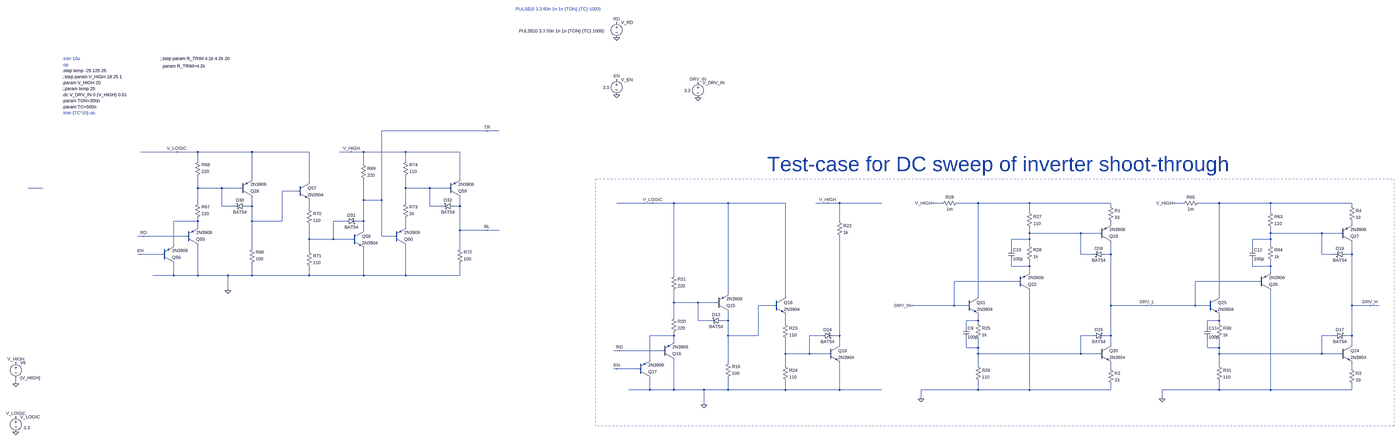
[diagram p0: schematic line_switch_driver.asc, whole sheet]
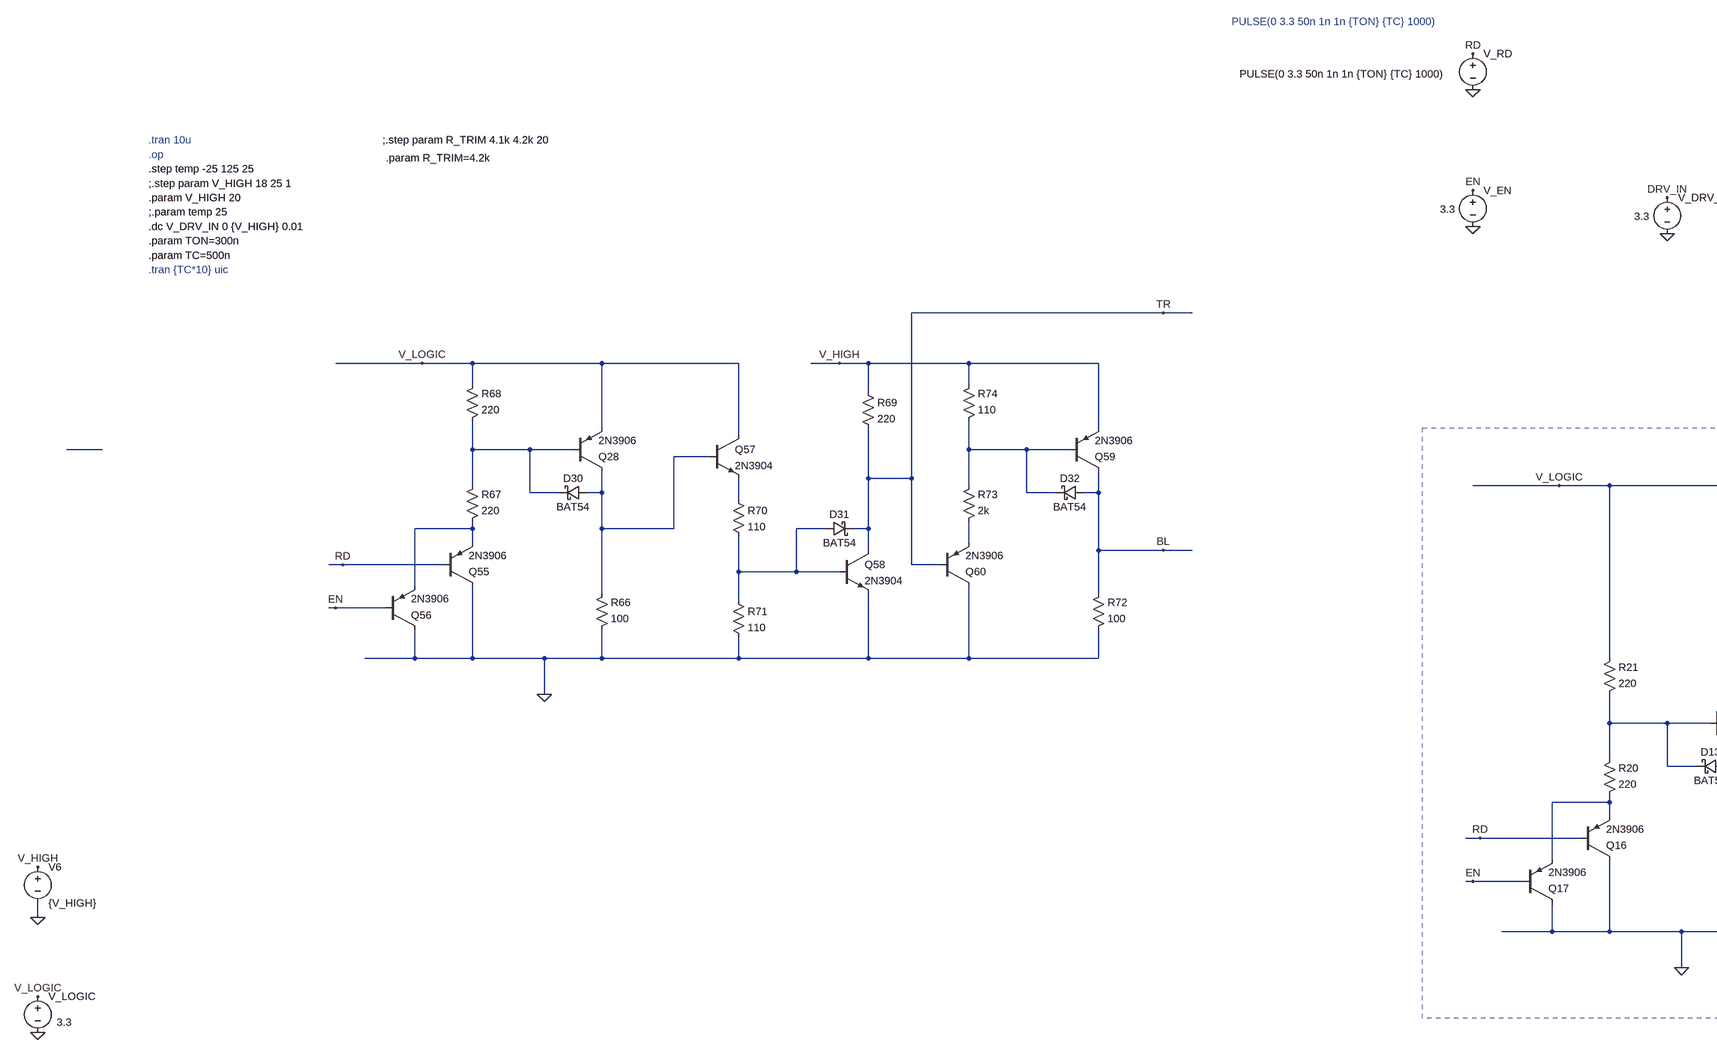
[diagram p1: schematic line_switch_driver.asc, part, row 1 of 1, column 1 of 2]
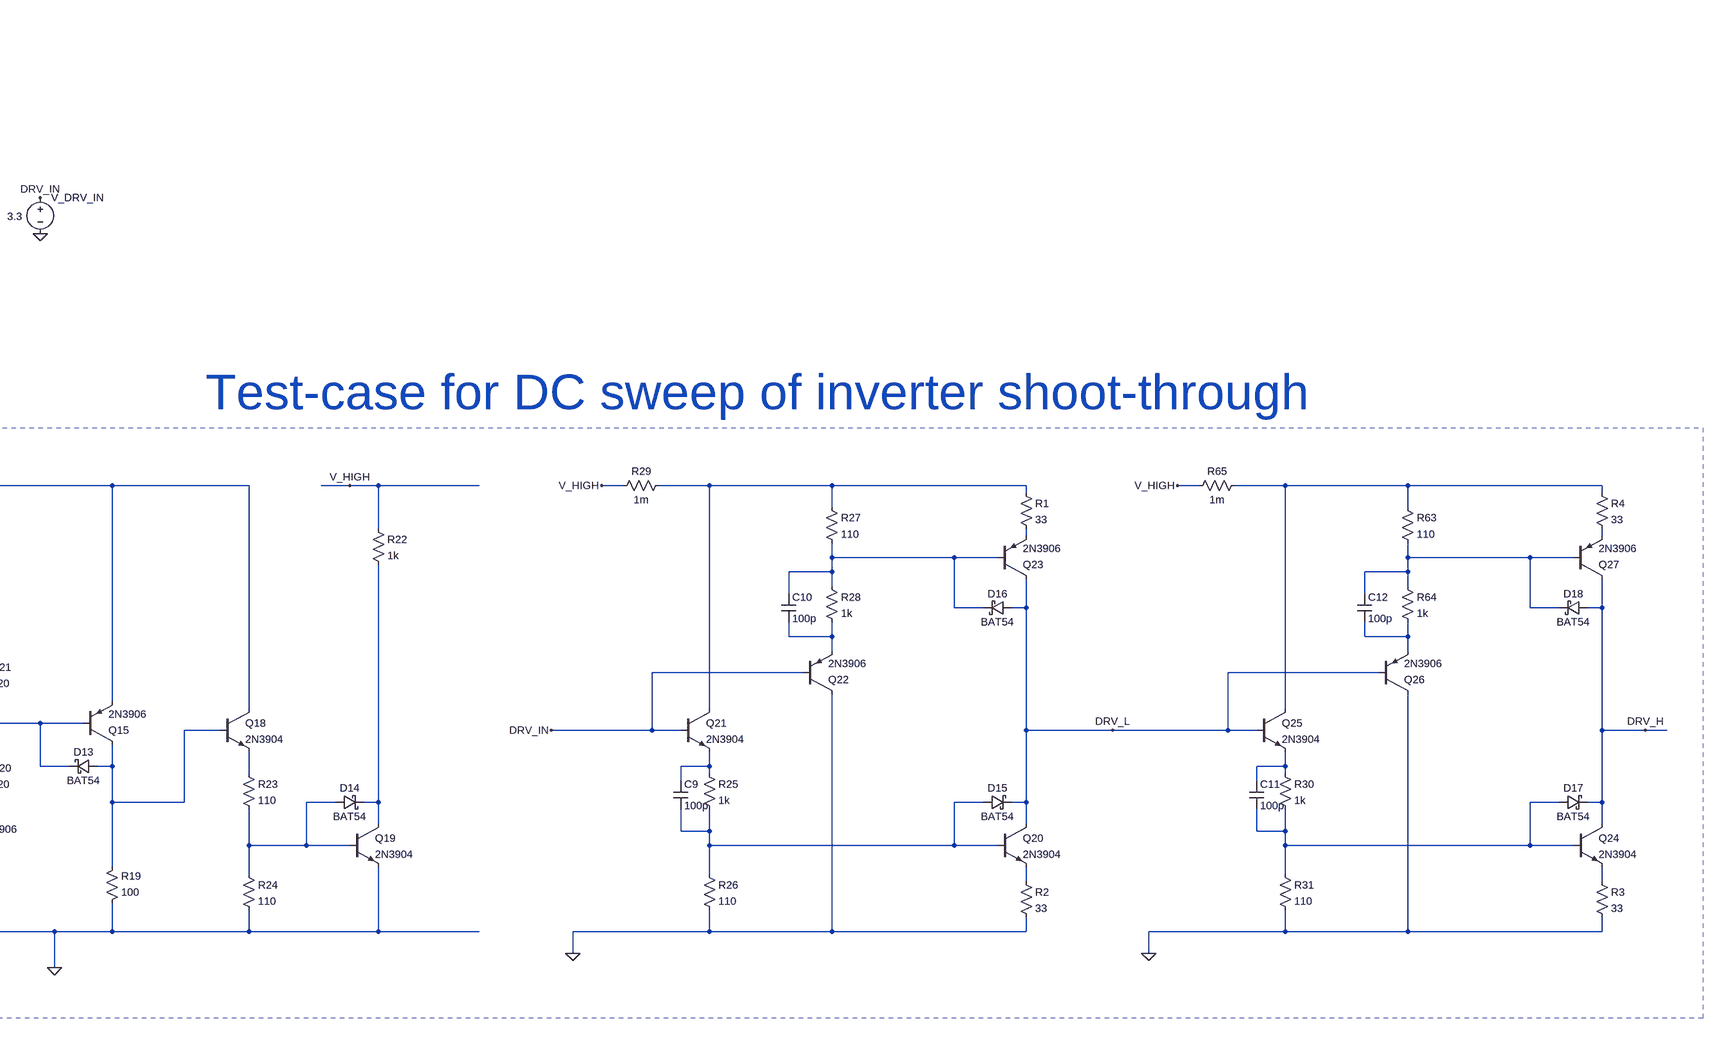
[diagram p2: schematic line_switch_driver.asc, part, row 1 of 1, column 2 of 2]
line_switch_driver.asc, the LTspice schematic file:
Version 4.1
SHEET 1 8816 5700
WIRE -1008 256 -1568 256
WIRE -944 256 -1008 256
WIRE -2656 368 -2848 368
WIRE -2544 368 -2656 368
WIRE -2256 368 -2544 368
WIRE -1952 368 -2256 368
WIRE -1728 368 -1792 368
WIRE -1664 368 -1728 368
WIRE -1440 368 -1664 368
WIRE -1152 368 -1440 368
WIRE -2544 416 -2544 368
WIRE -1440 416 -1440 368
WIRE -1664 432 -1664 368
WIRE -2256 512 -2256 368
WIRE -1152 512 -1152 368
WIRE -1952 528 -1952 368
WIRE -3376 560 -3456 560
WIRE -2544 560 -2544 496
WIRE -2416 560 -2544 560
WIRE -2320 560 -2416 560
WIRE -1440 560 -1440 496
WIRE -1312 560 -1440 560
WIRE -1216 560 -1312 560
WIRE -2016 576 -2096 576
WIRE -1664 624 -1664 512
WIRE -1568 624 -1568 256
WIRE -1568 624 -1664 624
WIRE -2544 640 -2544 560
WIRE -1440 640 -1440 560
WIRE -128 640 -320 640
WIRE -16 640 -128 640
WIRE 272 640 -16 640
WIRE 576 640 272 640
WIRE 800 640 736 640
WIRE 864 640 800 640
WIRE 1088 640 864 640
WIRE 1408 640 1360 640
WIRE 1600 640 1488 640
WIRE 1872 640 1600 640
WIRE 2304 640 1872 640
WIRE 2688 640 2640 640
WIRE 2880 640 2768 640
WIRE 3152 640 2880 640
WIRE 3584 640 3152 640
WIRE -2416 656 -2416 560
WIRE -2352 656 -2416 656
WIRE -2256 656 -2256 608
WIRE -2256 656 -2288 656
WIRE -1312 656 -1312 560
WIRE -1248 656 -1312 656
WIRE -1152 656 -1152 608
WIRE -1152 656 -1184 656
WIRE 2304 656 2304 640
WIRE 3584 656 3584 640
WIRE -1952 672 -1952 624
WIRE 1872 688 1872 640
WIRE 3152 688 3152 640
WIRE -2544 736 -2544 720
WIRE -2544 736 -2672 736
WIRE -2256 736 -2256 656
WIRE -2096 736 -2096 576
WIRE -2096 736 -2256 736
WIRE -1760 736 -1824 736
WIRE -1664 736 -1664 624
WIRE -1664 736 -1696 736
WIRE 864 736 864 640
WIRE 2304 752 2304 736
WIRE 3584 752 3584 736
WIRE -2544 768 -2544 736
WIRE -1440 768 -1440 720
WIRE -1664 784 -1664 736
WIRE -1152 784 -1152 656
WIRE -1008 784 -1152 784
WIRE -944 784 -1008 784
WIRE 1872 800 1872 768
WIRE 2144 800 1872 800
WIRE 2240 800 2144 800
WIRE 3152 800 3152 768
WIRE 3424 800 3152 800
WIRE 3520 800 3424 800
WIRE -2832 816 -2864 816
WIRE -2608 816 -2832 816
WIRE -1568 816 -1568 624
WIRE -1504 816 -1568 816
WIRE -1952 832 -1952 752
WIRE -1824 832 -1824 736
WIRE -1824 832 -1952 832
WIRE -1728 832 -1824 832
WIRE 1872 832 1872 800
WIRE 1872 832 1776 832
WIRE 3152 832 3152 800
WIRE 3152 832 3056 832
WIRE -2672 864 -2672 736
WIRE 1872 864 1872 832
WIRE 3152 864 3152 832
WIRE -2256 880 -2256 736
WIRE -1152 880 -1152 784
WIRE 1776 880 1776 832
WIRE 3056 880 3056 832
WIRE -1952 896 -1952 832
WIRE -2848 912 -2864 912
WIRE -2736 912 -2848 912
WIRE 2144 912 2144 800
WIRE 2208 912 2144 912
WIRE 2304 912 2304 848
WIRE 2304 912 2272 912
WIRE 3424 912 3424 800
WIRE 3488 912 3424 912
WIRE 3584 912 3584 848
WIRE 3584 912 3552 912
WIRE 1776 976 1776 944
WIRE 1872 976 1872 944
WIRE 1872 976 1776 976
WIRE 3056 976 3056 944
WIRE 3152 976 3152 944
WIRE 3152 976 3056 976
WIRE 1872 1008 1872 976
WIRE 3152 1008 3152 976
WIRE -2672 1024 -2672 960
WIRE -2672 1024 -2784 1024
WIRE -2544 1024 -2544 864
WIRE -2544 1024 -2672 1024
WIRE -2384 1024 -2544 1024
WIRE -2256 1024 -2256 960
WIRE -2256 1024 -2384 1024
WIRE -1952 1024 -1952 976
WIRE -1952 1024 -2256 1024
WIRE -1664 1024 -1664 880
WIRE -1664 1024 -1952 1024
WIRE -1440 1024 -1440 864
WIRE -1440 1024 -1664 1024
WIRE -1152 1024 -1152 960
WIRE -1152 1024 -1440 1024
WIRE -16 1024 -16 640
WIRE 1808 1056 1472 1056
WIRE 3088 1056 2752 1056
WIRE -2384 1104 -2384 1024
WIRE 272 1120 272 640
WIRE 576 1136 576 640
WIRE 1600 1136 1600 640
WIRE 2880 1136 2880 640
WIRE -16 1168 -16 1104
WIRE 112 1168 -16 1168
WIRE 208 1168 112 1168
WIRE 512 1184 432 1184
WIRE 1472 1184 1472 1056
WIRE 1472 1184 1248 1184
WIRE 1536 1184 1472 1184
WIRE 2304 1184 2304 912
WIRE 2496 1184 2304 1184
WIRE 2752 1184 2752 1056
WIRE 2752 1184 2496 1184
WIRE 2816 1184 2752 1184
WIRE 3584 1184 3584 912
WIRE 3680 1184 3584 1184
WIRE 3728 1184 3680 1184
WIRE -16 1248 -16 1168
WIRE 112 1264 112 1168
WIRE 176 1264 112 1264
WIRE 272 1264 272 1216
WIRE 272 1264 240 1264
WIRE 1600 1264 1600 1232
WIRE 1600 1264 1536 1264
WIRE 2880 1264 2880 1232
WIRE 2880 1264 2816 1264
WIRE 576 1280 576 1232
WIRE 1600 1280 1600 1264
WIRE 2880 1280 2880 1264
WIRE 1536 1296 1536 1264
WIRE 2816 1296 2816 1264
WIRE -16 1344 -16 1328
WIRE -16 1344 -144 1344
WIRE 272 1344 272 1264
WIRE 432 1344 432 1184
WIRE 432 1344 272 1344
WIRE 768 1344 704 1344
WIRE 864 1344 864 816
WIRE 864 1344 832 1344
WIRE 2208 1344 2144 1344
WIRE 2304 1344 2304 1184
WIRE 2304 1344 2272 1344
WIRE 3488 1344 3424 1344
WIRE 3584 1344 3584 1184
WIRE 3584 1344 3552 1344
WIRE -16 1376 -16 1344
WIRE 864 1392 864 1344
WIRE 2304 1392 2304 1344
WIRE 3584 1392 3584 1344
WIRE 1536 1408 1536 1360
WIRE 1600 1408 1600 1360
WIRE 1600 1408 1536 1408
WIRE 2816 1408 2816 1360
WIRE 2880 1408 2880 1360
WIRE 2880 1408 2816 1408
WIRE -304 1424 -336 1424
WIRE -80 1424 -304 1424
WIRE 576 1440 576 1360
WIRE 704 1440 704 1344
WIRE 704 1440 576 1440
WIRE 800 1440 704 1440
WIRE 1600 1440 1600 1408
WIRE 2144 1440 2144 1344
WIRE 2144 1440 1600 1440
WIRE 2240 1440 2144 1440
WIRE 2880 1440 2880 1408
WIRE 3424 1440 3424 1344
WIRE 3424 1440 2880 1440
WIRE 3520 1440 3424 1440
WIRE -144 1472 -144 1344
WIRE 272 1488 272 1344
WIRE 576 1504 576 1440
WIRE 1600 1504 1600 1440
WIRE 2880 1504 2880 1440
WIRE -320 1520 -336 1520
WIRE -208 1520 -320 1520
WIRE 2304 1520 2304 1488
WIRE 3584 1520 3584 1488
WIRE -3520 1600 -3520 1568
WIRE -144 1632 -144 1568
WIRE -144 1632 -256 1632
WIRE -16 1632 -16 1472
WIRE -16 1632 -144 1632
WIRE 144 1632 -16 1632
WIRE 272 1632 272 1568
WIRE 272 1632 144 1632
WIRE 576 1632 576 1584
WIRE 576 1632 272 1632
WIRE 864 1632 864 1488
WIRE 864 1632 576 1632
WIRE 1088 1632 864 1632
WIRE 1600 1632 1600 1584
WIRE 1600 1632 1296 1632
WIRE 1872 1632 1872 1104
WIRE 1872 1632 1600 1632
WIRE 2304 1632 2304 1600
WIRE 2304 1632 1872 1632
WIRE 2880 1632 2880 1584
WIRE 2880 1632 2576 1632
WIRE 3152 1632 3152 1104
WIRE 3152 1632 2880 1632
WIRE 3584 1632 3584 1600
WIRE 3584 1632 3152 1632
WIRE 1296 1680 1296 1632
WIRE 2576 1680 2576 1632
WIRE 144 1712 144 1632
FLAG -3520 1600 0
FLAG -3520 1488 V_HIGH
FLAG -320 -320 RD
FLAG -320 -240 0
FLAG -320 -16 EN
FLAG -320 64 0
FLAG -3520 1776 V_LOGIC
FLAG -3520 1856 0
FLAG -128 640 V_LOGIC
FLAG 800 640 V_HIGH
FLAG 144 1712 0
FLAG 1296 1680 0
FLAG 1360 640 V_HIGH
FLAG 2576 1680 0
FLAG 2640 640 V_HIGH
FLAG -304 1424 RD
FLAG -320 1520 EN
FLAG -2832 816 RD
FLAG -2656 368 V_LOGIC
FLAG -2848 912 EN
FLAG -1728 368 V_HIGH
FLAG -2384 1104 0
FLAG -1008 256 TR
FLAG -1008 784 BL
FLAG 2496 1184 DRV_L
FLAG 3680 1184 DRV_H
FLAG 1248 1184 DRV_IN
FLAG 112 0 DRV_IN
FLAG 112 80 0
SYMBOL voltage -3520 1472 R0
SYMATTR InstName V6
SYMATTR Value {V_HIGH}
SYMBOL voltage -320 -336 R0
WINDOW 123 0 0 Left 0
WINDOW 39 0 0 Left 0
WINDOW 3 -519 61 Left 2
SYMATTR Value PULSE(0 3.3 50n 1n 1n {TON} {TC} 1000)
SYMATTR InstName V_RD
SYMBOL voltage -320 -32 R0
WINDOW 123 0 0 Left 0
WINDOW 39 0 0 Left 0
WINDOW 3 -73 58 Left 2
SYMATTR Value 3.3
SYMATTR InstName V_EN
SYMBOL voltage -3520 1760 R0
WINDOW 123 0 0 Left 0
WINDOW 39 0 0 Left 0
WINDOW 3 42 73 Left 2
SYMATTR Value 3.3
SYMATTR InstName V_LOGIC
SYMBOL schottky 240 1280 M270
WINDOW 0 32 32 VTop 2
WINDOW 3 0 32 VBottom 2
SYMATTR InstName D13
SYMATTR Value BAT54
SYMATTR Description Diode
SYMATTR Type diode
SYMBOL res 256 1584 M180
WINDOW 0 36 76 Left 2
WINDOW 3 36 40 Left 2
SYMATTR InstName R19
SYMATTR Value 100
SYMBOL res -32 1344 M180
WINDOW 0 36 76 Left 2
WINDOW 3 36 40 Left 2
SYMATTR InstName R20
SYMATTR Value 220
SYMBOL res -32 1120 M180
WINDOW 0 36 76 Left 2
WINDOW 3 36 40 Left 2
SYMATTR InstName R21
SYMATTR Value 220
SYMBOL pnp 208 1216 M180
SYMATTR InstName Q15
SYMATTR Value 2N3906
SYMBOL pnp -80 1472 M180
SYMATTR InstName Q16
SYMATTR Value 2N3906
SYMBOL pnp -208 1568 M180
SYMATTR InstName Q17
SYMATTR Value 2N3906
SYMBOL schottky 768 1328 M90
WINDOW 0 0 32 VBottom 2
WINDOW 3 32 32 VTop 2
SYMATTR InstName D14
SYMATTR Value BAT54
SYMATTR Description Diode
SYMATTR Type diode
SYMBOL res 848 720 R0
SYMATTR InstName R22
SYMATTR Value 1k
SYMBOL res 560 1264 R0
SYMATTR InstName R23
SYMATTR Value 110
SYMBOL res 560 1488 R0
SYMATTR InstName R24
SYMATTR Value 110
SYMBOL npn 512 1136 R0
SYMATTR InstName Q18
SYMATTR Value 2N3904
SYMBOL npn 800 1392 R0
SYMATTR InstName Q19
SYMATTR Value 2N3904
SYMBOL npn 2240 1392 R0
SYMATTR InstName Q20
SYMATTR Value 2N3904
SYMBOL schottky 2208 1360 R270
WINDOW 0 32 32 VTop 2
WINDOW 3 0 32 VBottom 2
SYMATTR InstName D15
SYMATTR Value BAT54
SYMATTR Description Diode
SYMATTR Type diode
SYMBOL npn 1536 1136 R0
SYMATTR InstName Q21
SYMATTR Value 2N3904
SYMBOL res 1584 1264 R0
SYMATTR InstName R25
SYMATTR Value 1k
SYMBOL res 1584 1488 R0
SYMATTR InstName R26
SYMATTR Value 110
SYMBOL cap 1520 1296 R0
SYMATTR InstName C9
SYMATTR Value 100p
SYMBOL pnp 1808 1104 M180
SYMATTR InstName Q22
SYMATTR Value 2N3906
SYMBOL res 1856 672 R0
SYMATTR InstName R27
SYMATTR Value 110
SYMBOL res 1856 848 R0
SYMATTR InstName R28
SYMATTR Value 1k
SYMBOL cap 1760 880 R0
SYMATTR InstName C10
SYMATTR Value 100p
SYMBOL schottky 2272 896 R90
WINDOW 0 0 32 VBottom 2
WINDOW 3 32 32 VTop 2
SYMATTR InstName D16
SYMATTR Value BAT54
SYMATTR Description Diode
SYMATTR Type diode
SYMBOL pnp 2240 848 M180
SYMATTR InstName Q23
SYMATTR Value 2N3906
SYMBOL res 1392 656 R270
WINDOW 0 32 56 VTop 2
WINDOW 3 0 56 VBottom 2
SYMATTR InstName R29
SYMATTR Value 1m
SYMBOL npn 3520 1392 R0
SYMATTR InstName Q24
SYMATTR Value 2N3904
SYMBOL schottky 3488 1360 R270
WINDOW 0 32 32 VTop 2
WINDOW 3 0 32 VBottom 2
SYMATTR InstName D17
SYMATTR Value BAT54
SYMATTR Description Diode
SYMATTR Type diode
SYMBOL npn 2816 1136 R0
SYMATTR InstName Q25
SYMATTR Value 2N3904
SYMBOL res 2864 1264 R0
SYMATTR InstName R30
SYMATTR Value 1k
SYMBOL res 2864 1488 R0
SYMATTR InstName R31
SYMATTR Value 110
SYMBOL cap 2800 1296 R0
SYMATTR InstName C11
SYMATTR Value 100p
SYMBOL pnp 3088 1104 M180
SYMATTR InstName Q26
SYMATTR Value 2N3906
SYMBOL res 3136 672 R0
SYMATTR InstName R63
SYMATTR Value 110
SYMBOL res 3136 848 R0
SYMATTR InstName R64
SYMATTR Value 1k
SYMBOL cap 3040 880 R0
SYMATTR InstName C12
SYMATTR Value 100p
SYMBOL schottky 3552 896 R90
WINDOW 0 0 32 VBottom 2
WINDOW 3 32 32 VTop 2
SYMATTR InstName D18
SYMATTR Value BAT54
SYMATTR Description Diode
SYMATTR Type diode
SYMBOL pnp 3520 848 M180
SYMATTR InstName Q27
SYMATTR Value 2N3906
SYMBOL res 2672 656 R270
WINDOW 0 32 56 VTop 2
WINDOW 3 0 56 VBottom 2
SYMATTR InstName R65
SYMATTR Value 1m
SYMBOL schottky -2288 672 M270
WINDOW 0 32 32 VTop 2
WINDOW 3 0 32 VBottom 2
SYMATTR InstName D30
SYMATTR Value BAT54
SYMATTR Description Diode
SYMATTR Type diode
SYMBOL res -2272 976 M180
WINDOW 0 36 76 Left 2
WINDOW 3 36 40 Left 2
SYMATTR InstName R66
SYMATTR Value 100
SYMBOL res -2560 736 M180
WINDOW 0 36 76 Left 2
WINDOW 3 36 40 Left 2
SYMATTR InstName R67
SYMATTR Value 220
SYMBOL res -2560 512 M180
WINDOW 0 36 76 Left 2
WINDOW 3 36 40 Left 2
SYMATTR InstName R68
SYMATTR Value 220
SYMBOL pnp -2320 608 M180
SYMATTR InstName Q28
SYMATTR Value 2N3906
SYMBOL pnp -2608 864 M180
SYMATTR InstName Q55
SYMATTR Value 2N3906
SYMBOL pnp -2736 960 M180
SYMATTR InstName Q56
SYMATTR Value 2N3906
SYMBOL schottky -1760 720 M90
WINDOW 0 0 32 VBottom 2
WINDOW 3 32 32 VTop 2
SYMATTR InstName D31
SYMATTR Value BAT54
SYMATTR Description Diode
SYMATTR Type diode
SYMBOL res -1680 416 R0
SYMATTR InstName R69
SYMATTR Value 220
SYMBOL res -1968 656 R0
SYMATTR InstName R70
SYMATTR Value 110
SYMBOL res -1968 880 R0
SYMATTR InstName R71
SYMATTR Value 110
SYMBOL npn -2016 528 R0
SYMATTR InstName Q57
SYMATTR Value 2N3904
SYMBOL npn -1728 784 R0
SYMATTR InstName Q58
SYMATTR Value 2N3904
SYMBOL schottky -1184 672 M270
WINDOW 0 32 32 VTop 2
WINDOW 3 0 32 VBottom 2
SYMATTR InstName D32
SYMATTR Value BAT54
SYMATTR Description Diode
SYMATTR Type diode
SYMBOL res -1168 976 M180
WINDOW 0 36 76 Left 2
WINDOW 3 36 40 Left 2
SYMATTR InstName R72
SYMATTR Value 100
SYMBOL res -1456 736 M180
WINDOW 0 36 76 Left 2
WINDOW 3 36 40 Left 2
SYMATTR InstName R73
SYMATTR Value 2k
SYMBOL res -1456 512 M180
WINDOW 0 36 76 Left 2
WINDOW 3 36 40 Left 2
SYMATTR InstName R74
SYMATTR Value 110
SYMBOL pnp -1216 608 M180
SYMATTR InstName Q59
SYMATTR Value 2N3906
SYMBOL pnp -1504 864 M180
SYMATTR InstName Q60
SYMATTR Value 2N3906
SYMBOL voltage 112 -16 R0
WINDOW 123 0 0 Left 0
WINDOW 39 0 0 Left 0
WINDOW 3 -73 58 Left 2
SYMATTR Value 3.3
SYMATTR InstName V_DRV_IN
SYMBOL res 2288 640 R0
SYMATTR InstName R1
SYMATTR Value 33
SYMBOL res 2288 1504 R0
SYMATTR InstName R2
SYMATTR Value 33
SYMBOL res 3568 1504 R0
SYMATTR InstName R3
SYMATTR Value 33
SYMBOL res 3568 640 R0
SYMATTR InstName R4
SYMATTR Value 33
TEXT -3264 -64 Left 2 !.step temp -25 125 25
TEXT -3264 -96 Left 2 ;.op
TEXT -3264 -32 Left 2 !;.step param V_HIGH 18 25 1
TEXT -2744 -128 Left 2 !;.step param R_TRIM 4.1k 4.2k 20
TEXT -2736 -88 Left 2 !.param R_TRIM=4.2k
TEXT -3264 0 Left 2 !.param V_HIGH 20
TEXT -3264 32 Left 2 !;.param temp 25
TEXT -3264 -128 Left 2 ;.tran 10u
TEXT -3264 160 Left 2 ;.tran {TC*10} uic
TEXT -3264 96 Left 2 !.param TON=300n
TEXT -3264 128 Left 2 !.param TC=500n
TEXT -3264 64 Left 2 !.dc V_DRV_IN 0 {V_HIGH} 0.01
TEXT 480 432 Left 7 ;Test-case for DC sweep of inverter shoot-through
TEXT -856 -392 Left 2 ;PULSE(0 3.3 50n 1n 1n {TON} {TC} 1000)
RECTANGLE Normal 3808 1824 -432 512 2

The netlist it stands for:
* line_switch_driver.asc
V6 V_HIGH 0 {V_HIGH}
V_RD RD 0 PULSE(0 3.3 50n 1n 1n {TON} {TC} 1000)
V_EN EN 0 3.3
V_LOGIC V_LOGIC 0 3.3
D13 N018 N017 BAT54
R19 0 N018 100
R20 N022 N017 220
R21 N017 V_LOGIC 220
Q15 N018 N017 V_LOGIC 0 2N3906
Q16 0 RD N022 0 2N3906
Q17 0 EN N022 0 2N3906
D14 N023 N024 BAT54
R22 V_HIGH N024 1k
R23 N021 N023 110
R24 N023 0 110
Q18 V_LOGIC N018 N021 0 2N3904
Q19 N024 N023 0 0 2N3904
Q20 DRV_L N025 N027 0 2N3904
D15 N025 DRV_L BAT54
Q21 N005 DRV_IN N019 0 2N3904
R25 N019 N025 1k
R26 N025 0 110
C9 N019 N025 100p
Q22 0 DRV_IN N015 0 2N3906
R27 N005 N013 110
R28 N013 N015 1k
C10 N013 N015 100p
D16 DRV_L N013 BAT54
Q23 DRV_L N013 N010 0 2N3906
R29 V_HIGH N005 1m
Q24 DRV_H N026 N028 0 2N3904
D17 N026 DRV_H BAT54
Q25 N006 DRV_L N020 0 2N3904
R30 N020 N026 1k
R31 N026 0 110
C11 N020 N026 100p
Q26 0 DRV_L N016 0 2N3906
R63 N006 N014 110
R64 N014 N016 1k
C12 N014 N016 100p
D18 DRV_H N014 BAT54
Q27 DRV_H N014 N011 0 2N3906
R65 V_HIGH N006 1m
D30 N004 N002 BAT54
R66 0 N004 100
R67 N008 N002 220
R68 N002 V_LOGIC 220
Q28 N004 N002 V_LOGIC 0 2N3906
Q55 0 RD N008 0 2N3906
Q56 0 EN N008 0 2N3906
D31 N009 TR BAT54
R69 V_HIGH TR 220
R70 N007 N009 110
R71 N009 0 110
Q57 V_LOGIC N004 N007 0 2N3904
Q58 TR N009 0 0 2N3904
D32 BL N003 BAT54
R72 0 BL 100
R73 N012 N003 2k
R74 N003 V_HIGH 110
Q59 BL N003 V_HIGH 0 2N3906
Q60 0 TR N012 0 2N3906
V_DRV_IN DRV_IN 0 3.3
R1 N005 N010 33
R2 N027 0 33
R3 N028 0 33
R4 N006 N011 33
.model D D
.lib standard.dio
.model NPN NPN
.model PNP PNP
.lib standard.bjt
.step temp -25 125 25
* .op
;.step param V_HIGH 18 25 1
;.step param R_TRIM 4.1k 4.2k 20
.param R_TRIM=4.2k
.param V_HIGH 20
;.param temp 25
* .tran 10u
* .tran {TC*10} uic
.param TON=300n
.param TC=500n
.dc V_DRV_IN 0 {V_HIGH} 0.01
* Test-case for DC sweep of inverter shoot-through
* PULSE(0 3.3 50n 1n 1n {TON} {TC} 1000)
.backanno
.end